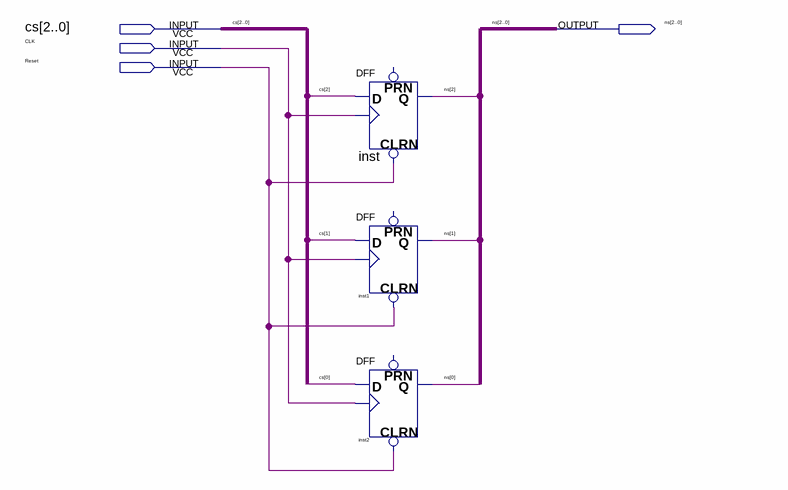
[diagram p0: schematic sheet]
// Quartus schematic Dffn.bdf as structural Verilog: 3 symbols, 4 pins
module Dffn (
  input  [2:0] cs,
  input  CLK,
  input  Reset,
  output [2:0] ns
);

  DFF inst (.CLRN(Reset), .CLK(CLK), .D(cs[2]), .Q(ns[2]));  // open: PRN
  DFF inst1 (.CLRN(Reset), .CLK(CLK), .D(cs[1]), .Q(ns[1]));  // open: PRN
  DFF inst2 (.CLRN(Reset), .CLK(CLK), .D(cs[0]), .Q(ns[0]));  // open: PRN
endmodule
